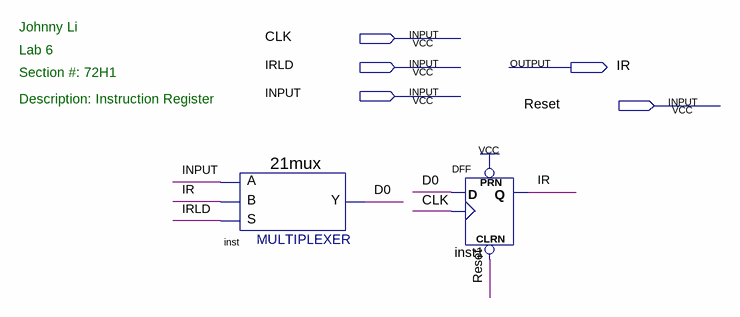
[diagram p0: schematic sheet]
// Quartus schematic InstructionRegister.bdf as structural Verilog: 2 symbols, 5 pins
module InstructionRegister (
  input  CLK,
  input  IRLD,
  input  INPUT,
  input  Reset,
  output IR
);

  wire D0;

  \21mux  inst (.S(IRLD), .B(IR), .A(INPUT), .Y(D0));
  DFF inst1 (.CLRN(Reset), .CLK(CLK), .D(D0), .PRN(1'b1), .Q(IR));

  // Notes on the sheet:
  //   Johnny Li 
  //   Lab 6 
  //   Section #: 72H1
  //   Description: Instruction Register
endmodule
